# Altium schematic sheet main.SchDoc
size Letter; CompanyName: Brinton Engineering, LLC; Address1: 3479 Edison Way; Address2: Menlo Park CA 94025; Address3: +1 (877) 778-8435; Address4: brintonengineering.com; Revision: 1; SheetNumber: 1; SheetTotal: 1
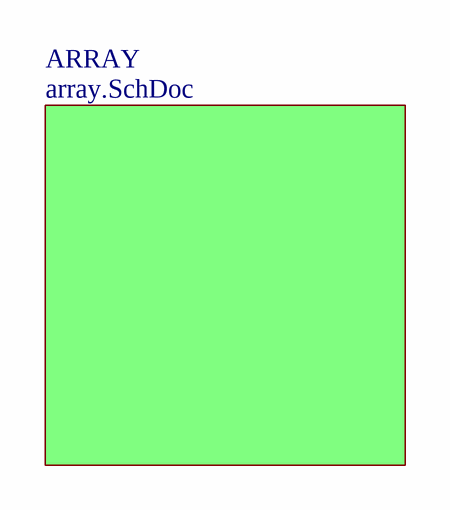
[diagram p0: main.SchDoc]

## Sub-sheets
ARRAY = array.SchDoc: no entries

## Notes on the sheet
- Title
- Engineer
- Revision
- Drawn By
- Checked By
- Date
- Sheet
- of